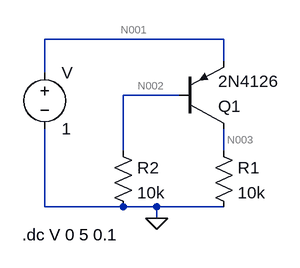
[diagram p0: schematic Draft1.asc]
Draft1.asc, the LTspice schematic file:
Version 4
SHEET 1 880 680
WIRE 160 80 -96 80
WIRE 160 112 160 80
WIRE -96 128 -96 80
WIRE 96 160 16 160
WIRE 16 240 16 160
WIRE 160 240 160 208
WIRE -96 320 -96 208
WIRE 16 320 -96 320
WIRE 64 320 16 320
WIRE 160 320 64 320
WIRE 64 336 64 320
FLAG 64 336 0
SYMBOL pnp 96 208 M180
SYMATTR InstName Q1
SYMATTR Value 2N4126
SYMBOL res 144 224 R0
SYMATTR InstName R1
SYMATTR Value 10k
SYMBOL res 0 224 R0
SYMATTR InstName R2
SYMATTR Value 10k
SYMBOL voltage -96 112 R0
SYMATTR InstName V
SYMATTR Value 1
TEXT -128 360 Left 2 !.dc V 0 5 0.1

The netlist it stands for:
* Draft1.asc
Q1 N003 N002 N001 0 2N4126
R1 N003 0 10k
R2 N002 0 10k
V N001 0 1
.model NPN NPN
.model PNP PNP
.lib standard.bjt
.dc V 0 5 0.1
.backanno
.end

* Results of the author's LTspice run, read from the files saved beside the schematic
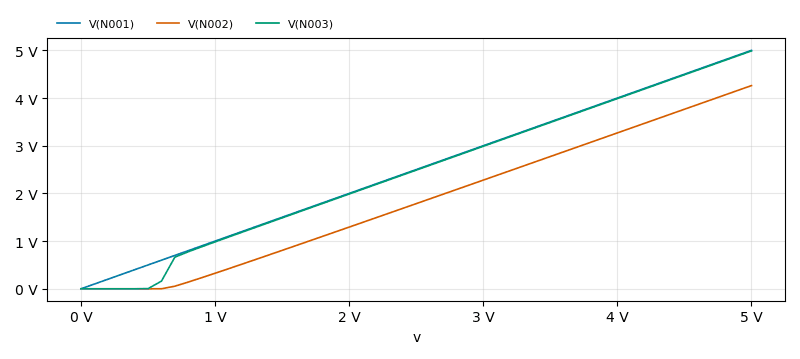
[diagram p1: DC transfer characteristic of Draft1.asc, plotted from the saved traces]
* DC transfer characteristic, 1 run:
*   V(N001): 0 V at v=0 V, 5 V at v=5 V, min 0 V, max 5 V
*   V(N002): 0 V at v=0 V, 4.261 V at v=5 V, min 0 V, max 4.261 V
*   V(N003): 0 V at v=0 V, 4.989 V at v=5 V, min 0 V, max 4.989 V